# Altium schematic sheet Connectors.SchDoc
size A; SheetNumber: 2; SheetTotal: 3
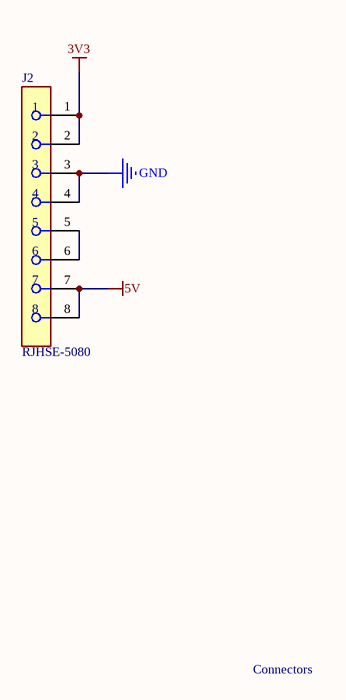
[diagram p0: Connectors.SchDoc]

## Parts
J2  RJHSE-5080  [FP-RJHSE-5080-MFG]

## Nets
3V3: J2.1 J2.2
5V: J2.7 J2.8
GND: J2.3 J2.4
NetJ2_5: J2.5 J2.6

## Notes on the sheet
- Connectors

## Library data of the parts
J2 = CMP-02366-000003-1: CONN MOD JACK 8P8C R/A UNSHLD; Manufacturer: Amphenol; Current Rating: 1.5A; Voltage Rating: 125V; Pitch: 1.02mm; Conn Orientation: Right Angle; Number Of Contacts: 8; Is Female: yes; Conn Gender: Female; Connector Type: TELECOM AND DATACOM CONNECTOR; Contact Style: TELCOM, MODULAR; Number of Ports: 1; PCB Contact Pattern: STAGGERED; Option: General Purpose; Empty Shell: No; Body Breadth: 0.52inch; Body Depth: 0.59inch; Body Length: 0.62inch; Mounting Option 1: LOCKING; Plating Thickness: 50uin; Reference Standard: UL; Reliability: COMMERCIAL; Lead Free: Yes; Device Class L3: unset; Footprint Url: https://cdn.amphenol-icc.com/media/wysiwyg/files/drawing/rjhse5080.pdf?__cf_chl_jschl_tk__=e349db0bbbb6188a39347cd5e541b92fa02c9719-1587748343-0-AW7tChdeHzRPLX9gSWj7WrKaXQoY9BsmT9Ek0h-T62M9y3Rs9iypFcOtkzb-6sGYQEjFE-jcoNciDETCOZrh1rYyOesac5SvYLoLwHIsHvF4AKBlx-MXmfZUVk9OTTJLqyQq2qMm0PFRLJpNcK0nrKResqOniRSYixG2sPTmOPraH-ULJFBDL602CHqcI9KKBgTq90Jh1OL2Td4moJ99rFsJRJ1Tk_uoxGe8ublcP_ARu-uLpWcQrBcwOcHDTAwL29DAwVaqcH7ta8Ks7WMlHmVl_pILeEDwT0bE9vu5Pa5S3PtNRF1leuFkgi_FMbUxTDulc5xzbXSfng8srUIV1lWXny5nx1fZJEUa_w97yKjffzBMxiWLWVN-V7-uqAaPbyv_m-wRyw5O25OZNyJOeGU; ComponentLink2URL: https://cdn.amphenol-icc.com/media/wysiwyg/files/documentation/datasheet/inputoutput/io-modjack-rjhse.pdf; Device Class L1: Connectors; Package: CONN_MOD_JACK; Mouser Description: Modular Connectors / Ethernet Connectors R/A RJ45 NONSHIELDED 8 CONT NO LEDS; Manufacturer Part Number: RJHSE-5080; Octopart: https://octopart.com/rjhse-5080-amphenol-45060; Category: Conn; Height: 0.535inch; Temperature: -55°C to +85°C; Digikey Description: CONN MOD JACK 8P8C R/A UNSHLD; Device Class L2: Modular / Ethernet Connectors; Contact Material: Gold,Nickel; ComponentLink2Description: Datasheet; Temperature Range Low: -55°C; RoHS: TRUE; Automotive: No; Temperature Range High: +85°C; Supplier: Digikey; Supplier Part Number: RJHSE-5080-ND; Stock: 69947; Pricing: 1=1.03, 10=0.867, 36=0.83194, 72=0.81417, 108=0.7788, 252=0.70802, 504=0.6372, 1008=0.56641, 2520=0.51331 (USD); Mounting Technology: Panel,Board; Contact Finish - Mating: GOLD (50) OVER NICKEL (50); Contact Finish - Termination: Matte Tin (Sn); Insulation Color: Black; Insulation Material: Thermoplastic; Shell Material: Polyethylene; JESD-609 Code: e3; Body/Shell Style: JACK; Contact Gender: Female; Mounting Style: RIGHT ANGLE; Termination: Solder; Filter Feature: No; Mixed Contacts: No; Terminal Length: 0.1inch; Terminal Pitch: 2.032mm; Flammability Rating: UL94 V-0; Reach SVHC Compliant: Yes; RoHS Compliant: Yes; DIN Conformance: No; IEC Conformance: No; MIL Conformance: No; ComponentLink1URL: https://datasheet.ciiva.com:443/pdfs/VipMasterIC/IC/AMPH/AMPH-S-A0001396201/AMPH-S-A0001290431-1.pdf?src-supplier=IHS+Markit; ComponentLink1Description: https://datasheet.ciiva.com:443/pdfs/VipMasterIC/IC/AMPH/AMPH-S-A0001396201/AMPH-S-A0001290431-1.pdf?src-supplier=IHS+Markit; ComponentLink3URL: https://datasheet.ciiva.com/685/rjhse5080-685586.pdf?src-supplier=Digikey; ComponentLink3Description: https://datasheet.ciiva.com/685/rjhse5080-685586.pdf?src-supplier=Digikey; ComponentLink4URL: https://datasheet.ciiva.com/7629/1682821-7629402.pdf?src-supplier=Element14; ComponentLink4Description: https://datasheet.ciiva.com/7629/1682821-7629402.pdf?src-supplier=Element14; ComponentLink5URL: https://datasheet.ciiva.com/15171/getdatasheetpartid-643190-15171163.pdf?src-supplier=Verical; ComponentLink5Description: https://datasheet.ciiva.com/15171/getdatasheetpartid-643190-15171163.pdf?src-supplier=Verical; ComponentLink6URL: https://datasheet.ciiva.com/1432/1693748-1432448.pdf?src-supplier=Element14; ComponentLink6Description: https://datasheet.ciiva.com/1432/1693748-1432448.pdf?src-supplier=Element14